# Altium schematic sheet 15-OutputMultiplexing.SchDoc: Output Multiplexing
size A2; Date: 29/12/2023; DocumentNumber: 15; SheetNumber: 15; SheetTotal: 15
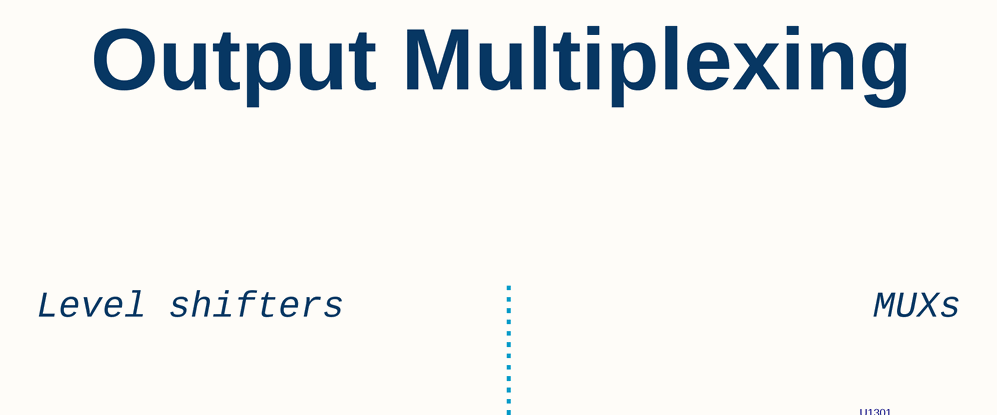
[diagram p0: 15-OutputMultiplexing.SchDoc, top left]
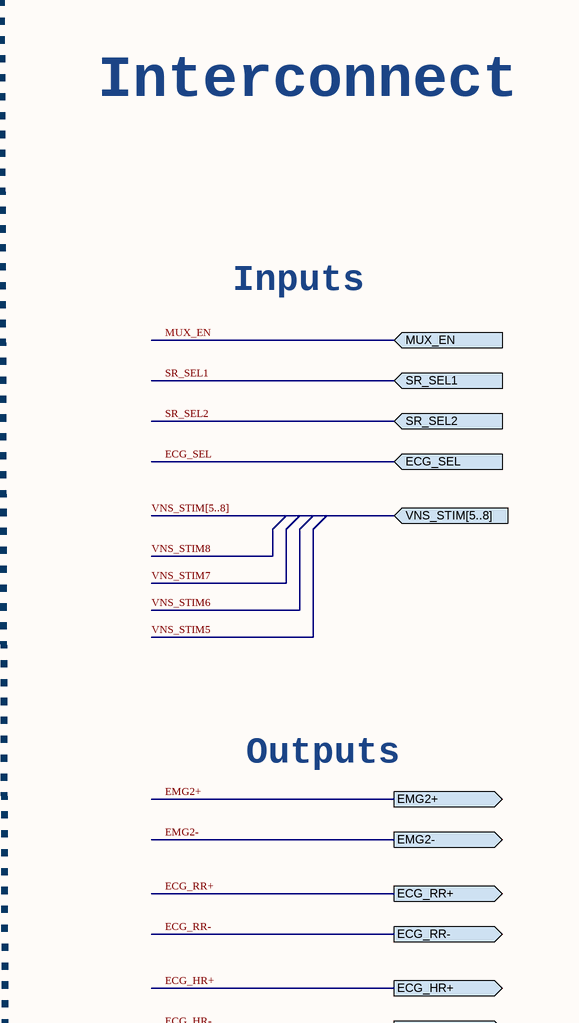
[diagram p1: 15-OutputMultiplexing.SchDoc, top right]
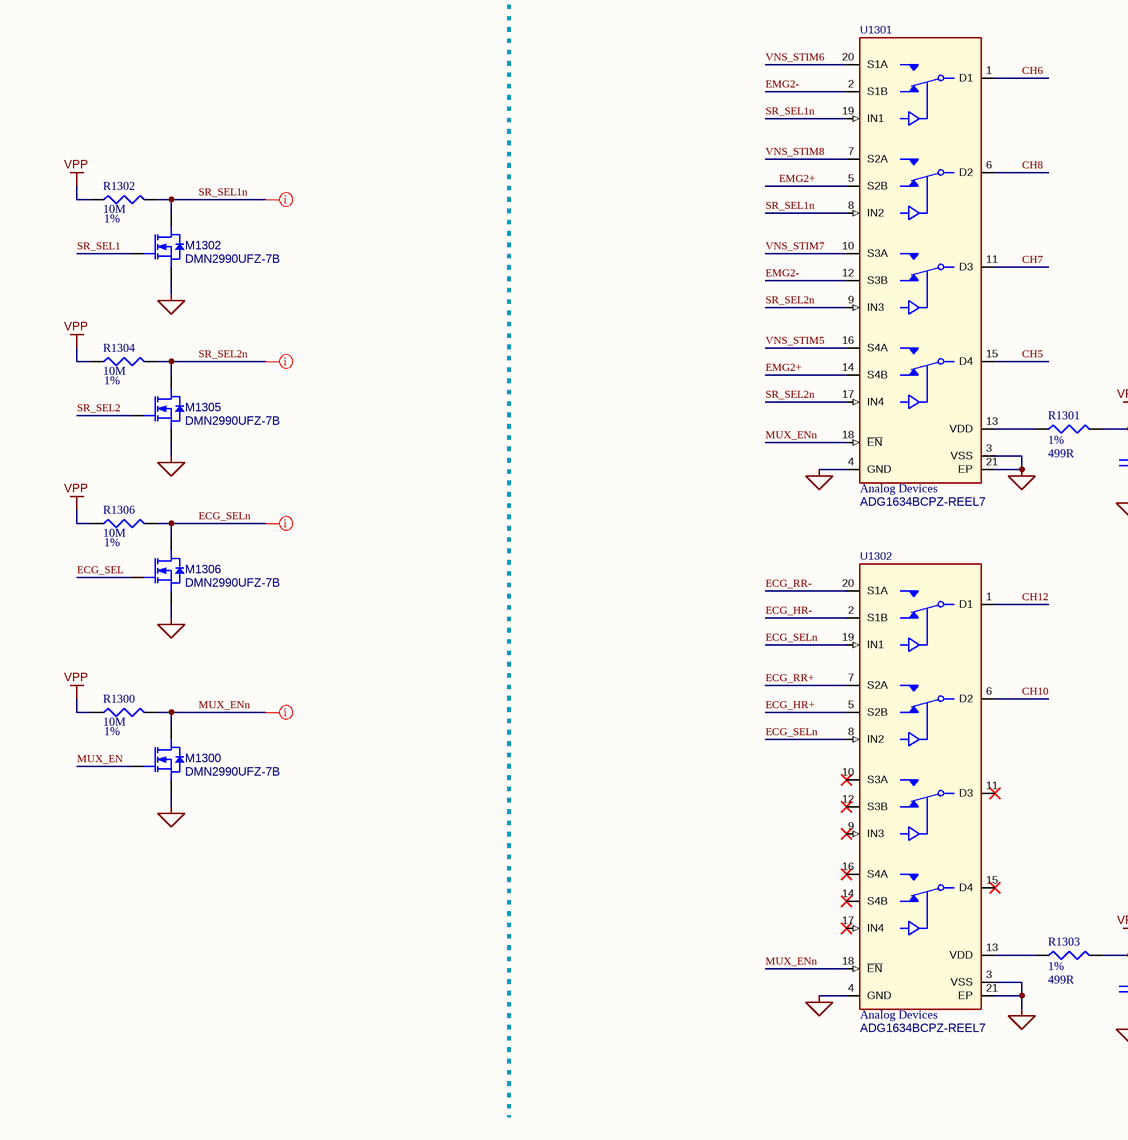
[diagram p2: 15-OutputMultiplexing.SchDoc, bottom left]
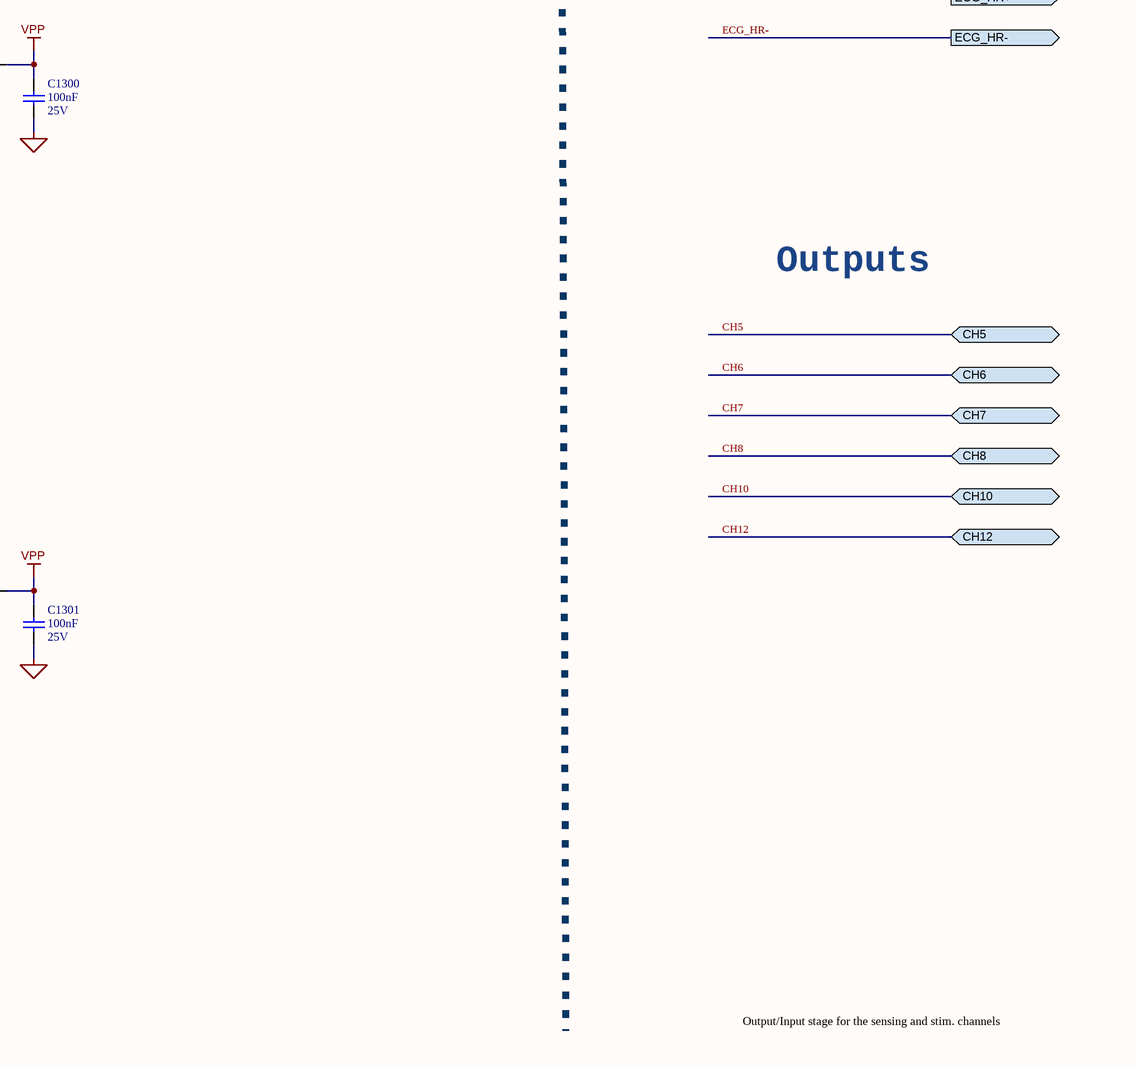
[diagram p3: 15-OutputMultiplexing.SchDoc, bottom right]

## Parts
C1300  value 100nF  Rated DC Voltage (URdc): 25V  [C0201_C]  (hidden comment: GRM033R61E104KE14J)
C1301  value 100nF  Rated DC Voltage (URdc): 25V  [C0201_C]  (hidden comment: GRM033R61E104KE14J)
M1300  DMN2990UFZ-7B  [DIODESINC_X2-DFN0606-3]
M1302  DMN2990UFZ-7B  [DIODESINC_X2-DFN0606-3]
M1305  DMN2990UFZ-7B  [DIODESINC_X2-DFN0606-3]
M1306  DMN2990UFZ-7B  [DIODESINC_X2-DFN0606-3]
R1300  value 10M  Tolerance: 1%  [R0201_C]  (hidden comment: CRCW020110M0FNED)
R1301  value 499R  Tolerance: 1%  [RES0402_REDUCED]  (hidden comment: CRCW0402499RFKEDHP)
R1302  value 10M  Tolerance: 1%  [R0201_C]  (hidden comment: CRCW020110M0FNED)
R1303  value 499R  Tolerance: 1%  [RES0402_REDUCED]  (hidden comment: CRCW0402499RFKEDHP)
R1304  value 10M  Tolerance: 1%  [R0201_C]  (hidden comment: CRCW020110M0FNED)
R1306  value 10M  Tolerance: 1%  [R0201_C]  (hidden comment: CRCW020110M0FNED)
U1301  Manufacturer: Analog Devices  [AD_CP-20-10]  (hidden comment: ADG1634BCPZ-REEL7)
U1302  Manufacturer: Analog Devices  [AD_CP-20-10]  (hidden comment: ADG1634BCPZ-REEL7)

## Ports
CH5 (bidir), CH6 (bidir), CH7 (bidir), CH8 (bidir), CH10 (bidir), CH12 (bidir), ECG_HR+ (out), ECG_HR- (out), ECG_RR+ (out), ECG_RR- (out), ECG_SEL (in), EMG2+ (out), EMG2- (out), MUX_EN (in), SR_SEL1 (in), SR_SEL2 (in), VNS_STIM[5..8] (in)

## Nets
GND: C1300.1 C1301.1 M1300.2(S) M1302.2(S) M1305.2(S) M1306.2(S) U1301.3(VSS) U1301.4(GND) U1301.21(EP) U1302.3(VSS) U1302.4(GND) U1302.21(EP)
VPP: C1300.2 C1301.2 R1300.1 R1301.2 R1302.1 R1303.2 R1304.1 R1306.1
CH5: U1301.15(D4) ; port CH5
CH6: U1301.1(D1) ; port CH6
CH7: U1301.11(D3) ; port CH7
CH8: U1301.6(D2) ; port CH8
CH10: U1302.6(D2) ; port CH10
CH12: U1302.1(D1) ; port CH12
ECG_HR+: U1302.5(S2B) ; port ECG_HR+
ECG_HR-: U1302.2(S1B) ; port ECG_HR-
ECG_RR+: U1302.7(S2A) ; port ECG_RR+
ECG_RR-: U1302.20(S1A) ; port ECG_RR-
ECG_SEL: M1306.1(G) ; port ECG_SEL
ECG_SELn: M1306.3(D) R1306.2 U1302.8(IN2) U1302.19(IN1)
EMG2+: U1301.5(S2B) U1301.14(S4B) ; port EMG2+
EMG2-: U1301.2(S1B) U1301.12(S3B) ; port EMG2-
MUX_EN: M1300.1(G) ; port MUX_EN
MUX_ENn: M1300.3(D) R1300.2 U1301.18(~{EN}) U1302.18(~{EN})
SR_SEL1: M1302.1(G) ; port SR_SEL1
SR_SEL1n: M1302.3(D) R1302.2 U1301.8(IN2) U1301.19(IN1)
SR_SEL2: M1305.1(G) ; port SR_SEL2
SR_SEL2n: M1305.3(D) R1304.2 U1301.9(IN3) U1301.17(IN4)
VNS_STIM5: U1301.16(S4A)
VNS_STIM6: U1301.20(S1A)
VNS_STIM7: U1301.10(S3A)
VNS_STIM8: U1301.7(S2A)
NetR1301_1: R1301.1 U1301.13(VDD)
NetR1303_1: R1303.1 U1302.13(VDD)

Not connected (* = marked no-connect by the designer): U1302 9(IN3)* 10(S3A)* 11(D3)* 12(S3B)* 14(S4B)* 15(D4)* 16(S4A)* 17(IN4)*

## Buses and harness runs
bus VNS_STIM[5..8] = port VNS_STIM[5..8]

## Layout directives
net class DIGITAL: ECG_SELn, MUX_ENn, SR_SEL1n, SR_SEL2n

## Notes on the sheet
- Interconnect
- Inputs
- Output Multiplexing
- Level shifters
- MUXs
- Outputs
- Output/Input stage for the sensing and stim. channels
- Project:
- Schematic:
- Design by:
- Date:
- Ver:
- .
- Comments:
- Reviewed by:

## Library data of the parts
C1300 C1301 = GRM033R61E104KE14J: Ceramic Capacitor, Multilayer, Ceramic, 25V, 10% +Tol, 10% -Tol, X5R, 15% TC, 0.1uF, Surface Mount, 0201; Manufacturer: Murata; Multilayer: Yes; Category: Ceramic Capacitors; Supplier: Digikey; Supplier Part Number: 490-14571-1-ND; Manufacturer Part Number: GRM033R61E104KE14J; RoHS: Yes; Stock: 1540851; Pricing: 1=0,1, 10=0,033, 50=0,0192, 100=0,0148, 500=0,01118, 1000=0,00878, 2500=0,00798, 5000=0,00734 (USD); Mounting Technology: Surface Mount; Pins: 2; Dielectric Material: Ceramic; Package Shape: Rectangular; Case/Package: 0201; Terminal Finish: Nickel; Min Operating Temperature: -55°C; Max Operating Temperature: 85°C; JESD-609 Code: e3; Capacitor Type: Ceramic; Tolerance  (fill in as +-): 10%; Package Style: SMTMeter; Packaging: Tape and Reel; Tolerance (fill in as +-): 10%; Temperature Characteristics Code: X5R; Termination: Wraparound; Length: 0.6mm; Width: 0.3mm; Height: 0.3mm; Reach SVHC Compliant: Yes; RoHS Compliant: Yes; ComponentLink1URL: https://psearch.en.murata.com:443/capacitor/product/GRM033R61E104KE14%23.pdf?src-supplier=IHS+Markit; ComponentLink1Description: https://psearch.en.murata.com:443/capacitor/product/GRM033R61E104KE14%23.pdf?src-supplier=IHS+Markit; ComponentLink2URL: http://www.mouser.com/ds/2/281/c02e-2905.pdf?src-supplier=Mouser; ComponentLink2Description: http://www.mouser.com/ds/2/281/c02e-2905.pdf?src-supplier=Mouser; ComponentLink3URL: http://search.murata.co.jp/Ceramy/image/img/A01X/G101/ENG/GRM033R61E104KE14-01.pdf?src-supplier=Digikey; ComponentLink3Description: http://search.murata.co.jp/Ceramy/image/img/A01X/G101/ENG/GRM033R61E104KE14-01.pdf?src-supplier=Digikey; ComponentLink4URL: https://search.murata.co.jp/Ceramy/image/img/A01X/G101/ENG/GRM033R61E104KE14-01.pdf?src-supplier=Digikey; ComponentLink4Description: https://search.murata.co.jp/Ceramy/image/img/A01X/G101/ENG/GRM033R61E104KE14-01.pdf?src-supplier=Digikey; Supplier 1: Arrow Electronics; Supplier Part Number 1: GRM033R61E104KE14J
M1300 M1302 M1305 M1306 = DMN2990UFZ-7B: MOSFET, N-Chan, 20V, 170mA, DFN0606; Manufacturer: Diodes Inc; Medical Grade MFR: TBD; Review: 020823; Category: Transistor; Length (mm): 0.62 ±0.05; Medical Grade MFR PN: TBD; PCB Footprint: TBD; Rating: 20V; Thickness (mm): 0.38 ±0.02; Value: DMN2990UFZ-7B; Width (mm): 0.62 ±0.05; Supplier 1: Digi-Key; Supplier Part Number 1: DMN2990UFZ-7BDICT-ND; Status: Approved; Manufacturer Part Number: DMN2990UFZ-7B
R1300 R1302 R1304 R1306 = CRCW020110M0FNED: Fixed Resistor, Metal Glaze/thick Film, 0.05W, 10000000ohm, 30V, 1% +/-Tol, 200ppm/Cel, Surface Mount, 0201; Manufacturer: Vishay Draloric; Medical Grade MFR: Mini-Systems; Medical Grade MFR PN: MWA96SM-1005F-NS62TR; Power: 50mW; Rated Temperature: 70°C; Temperature Coefficient: 200ppm/°C; Category: Chip SMD Resistors; Supplier: Mouser; Supplier Part Number: 71-CRCW020110M0FNED; Manufacturer Part Number: CRCW020110M0FNED; RoHS: Yes; Stock: 159754; Pricing: 1=0,1, 10=0,024, 50=0,024, 100=0,014, 1000=0,011, 10000=0,006 (USD); Mounting Technology: Surface Mount; Pins: 2; Package Shape: Rectangular; Case/Package: 0201; Terminal Finish: Nickel; Min Operating Temperature: -55°C; Max Operating Temperature: 155°C; JESD-609 Code: e3; Resistor Type: FIXED RESISTOR; Packaging: Tape and Reel; Technology: METAL GLAZE/THICK FILM; Termination: Wraparound; Working Voltage: 30V; Reach SVHC Compliant: Yes; RoHS Compliant: Yes; ComponentLink1URL: https://datasheet.ciiva.com:443/pdfs/VipMasterIC/IC/VISH/VISH-S-A0002932828/VISH-S-A0002932828-1.pdf?src-supplier=IHS+Markit; ComponentLink1Description: https://datasheet.ciiva.com:443/pdfs/VipMasterIC/IC/VISH/VISH-S-A0002932828/VISH-S-A0002932828-1.pdf?src-supplier=IHS+Markit; ComponentLink2URL: https://datasheet.ciiva.com/7673/1719906-7673177.pdf?src-supplier=Element14; ComponentLink2Description: https://datasheet.ciiva.com/7673/1719906-7673177.pdf?src-supplier=Element14; ComponentLink3URL: https://datasheet.ciiva.com/7673/1719906-7673178.pdf?src-supplier=Element14; ComponentLink3Description: https://datasheet.ciiva.com/7673/1719906-7673178.pdf?src-supplier=Element14; ComponentLink4URL: https://datasheet.ciiva.com/22692/1719906-22692711.pdf?src-supplier=Element14; ComponentLink4Description: https://datasheet.ciiva.com/22692/1719906-22692711.pdf?src-supplier=Element14; ComponentLink5URL: https://datasheet.ciiva.com/22665/1700795-22665701.pdf?src-supplier=Element14; ComponentLink5Description: https://datasheet.ciiva.com/22665/1700795-22665701.pdf?src-supplier=Element14; Supplier 1: Digikey; Supplier Part Number 1: 541-CRCW020110M0FNEDCT-ND
R1301 R1303 = CRCW0402499RFKEDHP: Fixed Resistor, Metal Glaze/thick Film, 0.2W, 499ohm, 50V, 1% +/-Tol, 100ppm/Cel, Surface Mount, 0402; Manufacturer: Vishay Dale; Manufacturer Series: CRCW-HPE3; Medical Grade MFR: TBD; Power: 200mW; Rated Temperature: 70°C; Temperature Coefficient: 100ppm/°C; Package Height: 0.3mm; Package Length: 1mm; Package Width: 0.5mm; Reference Standard: AEC-Q200; Supplier: Digikey; Supplier Part Number: 541-499YCT-ND; Manufacturer Part Number: CRCW0402499RFKEDHP; RoHS: Yes; Category: Chip SMD Resistors; Stock: 50100; Pricing: 1=0.13, 10=0.061, 50=0.0402, 100=0.0341, 500=0.024, 1000=0.02091, 5000=0.01572 (USD); Mounting Technology: Surface Mount; Pins: 2; Package Shape: Rectangular; Case/Package: 0402; Terminal Finish: Nickel; Min Operating Temperature: -55°C; Max Operating Temperature: 155°C; JESD-609 Code: e3; Resistor Type: FIXED RESISTOR; Construction: Chip; Package Style: SMTMeter; Packaging: Tape and Reel; Series: CRCW-HP E3; Technology: METAL GLAZE/THICK FILM; Termination: Wraparound; Working Voltage: 50V; Reach SVHC Compliant: Yes; RoHS Compliant: Yes; ComponentLink1URL: https://datasheet.ciiva.com:443/pdfs/VipMasterIC/IC/VISH/VISH-S-A0009391795/VISH-S-A0009391795-1.pdf?src-supplier=IHS+Markit; ComponentLink1Description: https://datasheet.ciiva.com:443/pdfs/VipMasterIC/IC/VISH/VISH-S-A0009391795/VISH-S-A0009391795-1.pdf?src-supplier=IHS+Markit; ComponentLink2URL: https://datasheet.ciiva.com/5540/crcwhpe3-46056-5540816.pdf?src-supplier=Mouser; ComponentLink2Description: https://datasheet.ciiva.com/5540/crcwhpe3-46056-5540816.pdf?src-supplier=Mouser; ComponentLink3URL: https://datasheet.ciiva.com/8932/crcwhpe3-8932421.pdf?src-supplier=Avnet; ComponentLink3Description: https://datasheet.ciiva.com/8932/crcwhpe3-8932421.pdf?src-supplier=Avnet; Supplier 1: Mouser; Supplier Part Number 1: 71-CRCW0402499RFKEDH; Medical Grade MFR PN: TBD
U1301 U1302 = ADG1634BCPZ-REEL7: IC SWITCH SPDTX4 4.5OHM 20LFCSP; PCB Footprint: TBD; Category: IC; Length (mm): 4.00 ±0.10; Medical Grade MFR: N/A; Medical Grade MFR PN: N/A; Rating: TBD; Thickness (mm): 0.75 ±0.05; Value: ADG1634BCPZ-REEL7; Width (mm): 4.00 ±0.10; Package Description: TBD; Supplier 1: Digi-Key; Supplier Part Number 1: 505-ADG1634BCPZ-REEL7CT-ND; Status: *; Review: *; Manufacturer Part Number: ADG1634BCPZ-REEL7